# Altium project 3L-FC-Converter.PrjPcb
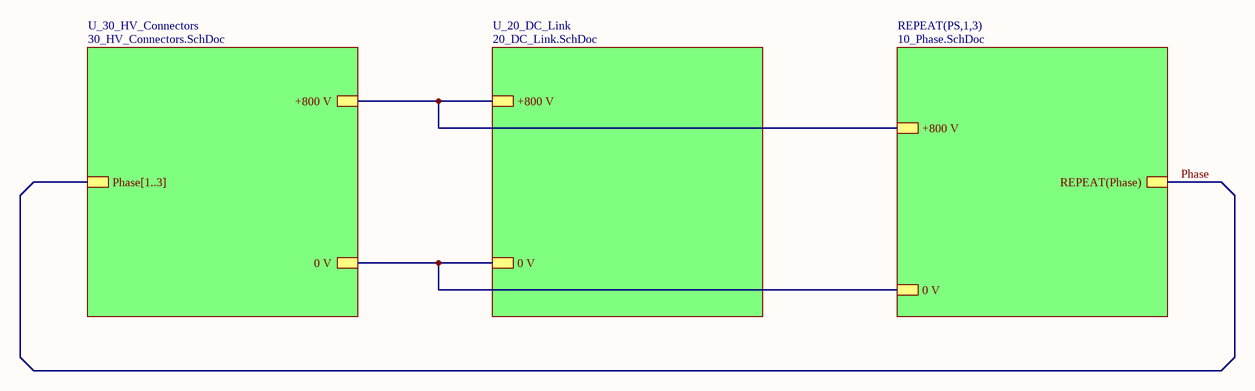
[diagram p0: 00_TopLevel.SchDoc]
4 sheets, 97 parts. Net scope: hierarchical (ports join the sheet entries above them; power ports are global).
Board file: Powerstage_3LFLC.PcbDoc.PcbDoc
Sheets:
  00_TopLevel.SchDoc
    PS1 = 10_Phase.SchDoc
    PS2 = 10_Phase.SchDoc
    PS3 = 10_Phase.SchDoc
    U_20_DC_Link = 20_DC_Link.SchDoc
    U_30_HV_Connectors = 30_HV_Connectors.SchDoc

## Sheet 00_TopLevel.SchDoc
size A4; SheetNumber: 1; SheetTotal: 4

### Sub-sheets
REPEAT(PS,1,3) = 10_Phase.SchDoc: REPEAT(Phase), +800 V, 0 V
U_20_DC_Link = 20_DC_Link.SchDoc: +800 V, 0 V
U_30_HV_Connectors = 30_HV_Connectors.SchDoc: 0 V, +800 V, Phase[1..3]

### Nets
0 V: sheet REPEAT(PS,1,3)/0 V, sheet U_20_DC_Link/0 V, sheet U_30_HV_Connectors/0 V
+800 V: sheet REPEAT(PS,1,3)/+800 V, sheet U_20_DC_Link/+800 V, sheet U_30_HV_Connectors/+800 V
Phase: sheet REPEAT(PS,1,3)/REPEAT(Phase)

## Sheet 10_Phase.SchDoc
size A4; SheetNumber: 2; SheetTotal: 4
Used 3 times, as channels PS1, PS2, PS3. Parts and nets are listed once, with the designators drawn on the sheet.
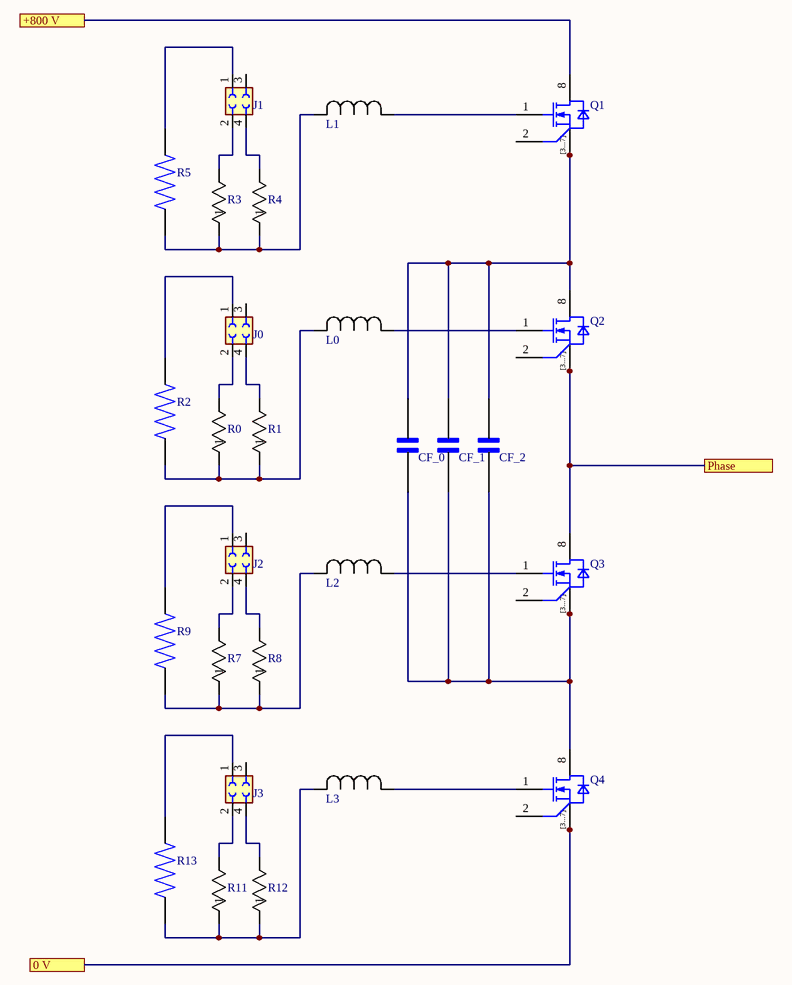
[diagram p1: 10_Phase.SchDoc]

### Parts
CF_0  B32776Z4406K000  [CAP_B32776Z4406K000]  (value not drawn)
CF_1  B32776Z4406K000  [CAP_B32776Z4406K000]  (value not drawn)
CF_2  B32776Z4406K000  [CAP_B32776Z4406K000]  (value not drawn)
J0  6230XX21021_62300421021  [62300421021]  (value not drawn)
J1  6230XX21021_62300421021  [62300421021]  (value not drawn)
J2  6230XX21021_62300421021  [62300421021]  (value not drawn)
J3  6230XX21021_62300421021  [62300421021]  (value not drawn)
L0  MPZ2012S300AT000  [IND_2012_TDK]  (value not drawn)
L1  MPZ2012S300AT000  [IND_2012_TDK]  (value not drawn)
L2  MPZ2012S300AT000  [IND_2012_TDK]  (value not drawn)
L3  MPZ2012S300AT000  [IND_2012_TDK]  (value not drawn)
Q1  IMBG120R026M2H  [TO127P1500X470-8N-2-V1]  (value not drawn)
Q2  IMBG120R026M2H  [TO127P1500X470-8N-2-V1]  (value not drawn)
Q3  IMBG120R026M2H  [TO127P1500X470-8N-2-V1]  (value not drawn)
Q4  IMBG120R026M2H  [TO127P1500X470-8N-2-V1]  (value not drawn)
R0  HCJ1206ZT0R00  [RES_HCJ1206_STP]  (value not drawn)
R1  HCJ1206ZT0R00  [RES_HCJ1206_STP]  (value not drawn)
R2  AF0805FR-07130RL  [RESC2012X60N]  (value not drawn)
R3  HCJ1206ZT0R00  [RES_HCJ1206_STP]  (value not drawn)
R4  HCJ1206ZT0R00  [RES_HCJ1206_STP]  (value not drawn)
R5  AF0805FR-07130RL  [RESC2012X60N]  (value not drawn)
R7  HCJ1206ZT0R00  [RES_HCJ1206_STP]  (value not drawn)
R8  HCJ1206ZT0R00  [RES_HCJ1206_STP]  (value not drawn)
R9  AF0805FR-07130RL  [RESC2012X60N]  (value not drawn)
R11  HCJ1206ZT0R00  [RES_HCJ1206_STP]  (value not drawn)
R12  HCJ1206ZT0R00  [RES_HCJ1206_STP]  (value not drawn)
R13  AF0805FR-07130RL  [RESC2012X60N]  (value not drawn)

### Ports
0 V (see 00_TopLevel, 20_DC_Link, 30_HV_Connectors), +800 V (see 00_TopLevel, 20_DC_Link, 30_HV_Connectors), Phase (see 00_TopLevel)

### Nets
0 V: Q4.3(SOURCE1) Q4.4(SOURCE2) Q4.5(SOURCE3) Q4.6(SOURCE4) Q4.7(SOURCE5) ; port 0 V
+800 V: Q1.8(DRAIN) ; port +800 V
Phase: Q2.3(SOURCE1) Q2.4(SOURCE2) Q2.5(SOURCE3) Q2.6(SOURCE4) Q2.7(SOURCE5) Q3.8(DRAIN) ; port Phase
NetCF_0_1: CF_0.1 CF_1.1 CF_2.1 Q3.3(SOURCE1) Q3.4(SOURCE2) Q3.5(SOURCE3) Q3.6(SOURCE4) Q3.7(SOURCE5) Q4.8(DRAIN)
NetCF_0_2: CF_0.2 CF_1.2 CF_2.2 Q1.3(SOURCE1) Q1.4(SOURCE2) Q1.5(SOURCE3) Q1.6(SOURCE4) Q1.7(SOURCE5) Q2.8(DRAIN)
NetJ0_1: J0.1 R2.2
NetJ0_2: J0.2 R0.2
NetJ0_4: J0.4 R1.2
NetJ1_1: J1.1 R5.2
NetJ1_2: J1.2 R3.2
NetJ1_4: J1.4 R4.2
NetJ2_1: J2.1 R9.2
NetJ2_2: J2.2 R7.2
NetJ2_4: J2.4 R8.2
NetJ3_1: J3.1 R13.2
NetJ3_2: J3.2 R11.2
NetJ3_4: J3.4 R12.2
NetL0_1: L0.1 Q2.1(GATE)
NetL0_2: L0.2 R0.1 R1.1 R2.1
NetL1_1: L1.1 Q1.1(GATE)
NetL1_2: L1.2 R3.1 R4.1 R5.1
NetL2_1: L2.1 Q3.1(GATE)
NetL2_2: L2.2 R7.1 R8.1 R9.1
NetL3_1: L3.1 Q4.1(GATE)
NetL3_2: L3.2 R11.1 R12.1 R13.1

Not connected (* = marked no-connect by the designer): J0 3; J1 3; J2 3; J3 3; Q1 2(SENSE); Q2 2(SENSE); Q3 2(SENSE); Q4 2(SENSE)

### Channels
PS1: designators CF_0=C4_PS1 CF_1=C5_PS1 CF_2=C6_PS1 J0=J0_PS1 J1=J1_PS1 J2=J2_PS1 J3=J3_PS1 L0=L0_PS1 L1=L1_PS1 L2=L2_PS1 L3=L3_PS1 Q1=Q1_PS1 Q2=Q2_PS1 Q3=Q3_PS1 Q4=Q4_PS1 R0=R0_PS1 R1=R1_PS1 R2=R2_PS1 R3=R3_PS1 R4=R4_PS1 R5=R5_PS1 R7=R7_PS1 R8=R8_PS1 R9=R9_PS1 R11=R11_PS1 R12=R12_PS1 R13=R13_PS1; ports 0 V=0 V +800 V=+800 V Phase=Phase1
PS2: designators CF_0=C4_PS2 CF_1=C5_PS2 CF_2=C6_PS2 J0=J0_PS2 J1=J1_PS2 J2=J2_PS2 J3=J3_PS2 L0=L0_PS2 L1=L1_PS2 L2=L2_PS2 L3=L3_PS2 Q1=Q1_PS2 Q2=Q2_PS2 Q3=Q3_PS2 Q4=Q4_PS2 R0=R0_PS2 R1=R1_PS2 R2=R2_PS2 R3=R3_PS2 R4=R4_PS2 R5=R5_PS2 R7=R7_PS2 R8=R8_PS2 R9=R9_PS2 R11=R11_PS2 R12=R12_PS2 R13=R13_PS2; ports 0 V=0 V +800 V=+800 V Phase=Phase2
PS3: designators CF_0=C4_PS3 CF_1=C5_PS3 CF_2=C6_PS3 J0=J0_PS3 J1=J1_PS3 J2=J2_PS3 J3=J3_PS3 L0=L0_PS3 L1=L1_PS3 L2=L2_PS3 L3=L3_PS3 Q1=Q1_PS3 Q2=Q2_PS3 Q3=Q3_PS3 Q4=Q4_PS3 R0=R0_PS3 R1=R1_PS3 R2=R2_PS3 R3=R3_PS3 R4=R4_PS3 R5=R5_PS3 R7=R7_PS3 R8=R8_PS3 R9=R9_PS3 R11=R11_PS3 R12=R12_PS3 R13=R13_PS3; ports 0 V=0 V +800 V=+800 V Phase=Phase3

### Notes on the sheet
- (in symbol IMBG120R026M2H) [3...7]

### Library data of the parts
CF_0-CF_2 = B32776Z4406K000: 40 ÂµF Film Capacitor 500V Polypropylene (PP), Metallized Radial - 4 Leads; MF: EPCOS; SnapEDA_Link: https://www.snapeda.com/parts/B32776Z4406K000/EPCOS/view-part/?ref=snap; Package: NON-STANDARD-4 EPCOS; Value: *; MP: B32776Z4406K000; Check_prices: https://www.snapeda.com/parts/B32776Z4406K000/EPCOS/view-part/?ref=eda
J0-J3 = 6230XX21021_62300421021: WR-PHD 1.27 mm Dual SMT Socket Header H=4.50mm; MF: Wurth Elektronik; SnapEDA_Link: https://www.snapeda.com/parts/62300421021/Wurth+Electronics/view-part/?ref=snap; Package: None; Value: *; MP: 62300421021; Check_prices: https://www.snapeda.com/parts/62300421021/Wurth+Electronics/view-part/?ref=eda
L0-L3 = MPZ2012S300AT000: Description; Manufacturer_Name: TDK; Copyright: Copyright (C) 2025 Ultra Librarian. All rights reserved.; Manufacturer_Part_Number: MPZ2012S300AT000
Q1-Q4 = IMBG120R026M2H: Insulated-Gate Field-Effect Transistor (IGFET), N-Channel, Enhancement, Body Diode, Pin 1 Gate, 2 Sense, 3 Source, 4 Source, 5 Source, 6 Source, 7 Source, 8 Drain, 8 Pins; Manufacturer: Infineon Technologies; Manufacturer Order Number: IMBG120R026M2H; Package Reference: PG-TO263-7-12
R0 R1 R3 R4 R7 R8 R11 R12 = HCJ1206ZT0R00: Description; Manufacturer_Name: Stackpole International; Copyright: Copyright (C) 2025 Ultra Librarian. All rights reserved.; Manufacturer_Part_Number: HCJ1206ZT0R00
R2 R5 R9 R13 = AF0805FR-07130RL: 130 Ohms Â±1% 0.125W, 1/8W Chip Resistor 0805 (2012 Metric) Anti-Sulfur, Automotive AEC-Q200 Thick Film; MF: Yageo; SnapEDA_Link: https://www.snapeda.com/parts/AF0805FR-07130RL/Yageo/view-part/?ref=snap; Package: 2012 Yageo; Value: *; MP: AF0805FR-07130RL; Check_prices: https://www.snapeda.com/parts/AF0805FR-07130RL/Yageo/view-part/?ref=eda

## Sheet 20_DC_Link.SchDoc
size A4; SheetNumber: 3; SheetTotal: 4
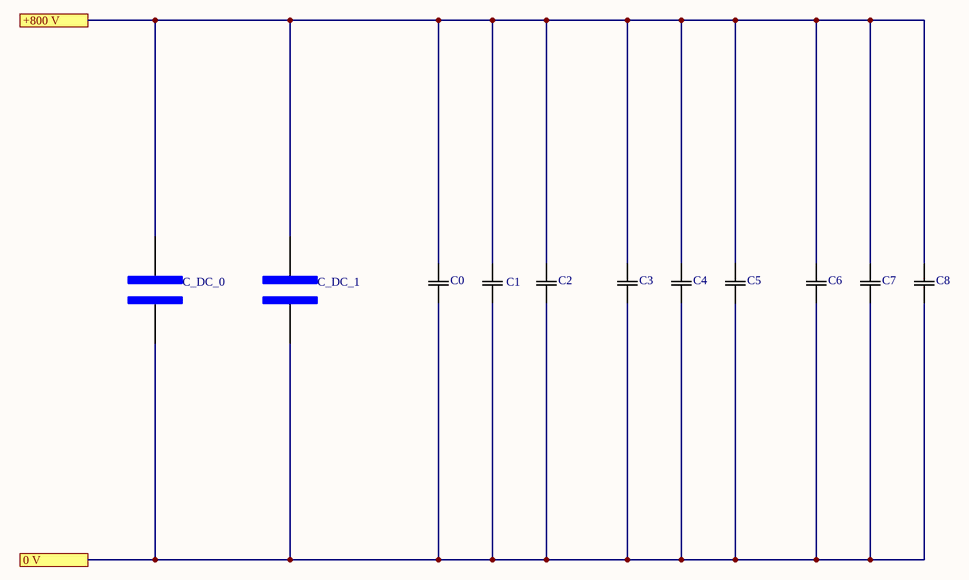
[diagram p2: 20_DC_Link.SchDoc]

### Parts
C0  2220Y1K00474KETWS2  [CAP_2220Y_KNO]  (value not drawn)
C1  2220Y1K00474KETWS2  [CAP_2220Y_KNO]  (value not drawn)
C2  2220Y1K00474KETWS2  [CAP_2220Y_KNO]  (value not drawn)
C3  2220Y1K00474KETWS2  [CAP_2220Y_KNO]  (value not drawn)
C4  2220Y1K00474KETWS2  [CAP_2220Y_KNO]  (value not drawn)
C5  2220Y1K00474KETWS2  [CAP_2220Y_KNO]  (value not drawn)
C6  2220Y1K00474KETWS2  [CAP_2220Y_KNO]  (value not drawn)
C7  2220Y1K00474KETWS2  [CAP_2220Y_KNO]  (value not drawn)
C8  2220Y1K00474KETWS2  [CAP_2220Y_KNO]  (value not drawn)
C_DC_0  B25654A6177K001  [B25654A6177K001]  (value not drawn)
C_DC_1  B25654A6177K001  [B25654A6177K001]  (value not drawn)

### Ports
0 V (see 00_TopLevel, 10_Phase, 30_HV_Connectors), +800 V (see 00_TopLevel, 10_Phase, 30_HV_Connectors)

### Nets
0 V: C0.1 C1.1 C2.1 C3.1 C4.1 C5.1 C6.1 C7.1 C8.1 C_DC_0.2 C_DC_1.2 ; port 0 V
+800 V: C0.2 C1.2 C2.2 C3.2 C4.2 C5.2 C6.2 C7.2 C8.2 C_DC_0.1 C_DC_1.1 ; port +800 V

### Library data of the parts
C0-C8 = 2220Y1K00474KETWS2: Description; Manufacturer_Name: Knowles; Type: Ceramic Capacitors; Copyright: Copyright (C) 2026 Ultra Librarian. All rights reserved.; Manufacturer_Part_Number: 2220Y1K00474KETWS2

## Sheet 30_HV_Connectors.SchDoc
size A4; SheetNumber: 4; SheetTotal: 4
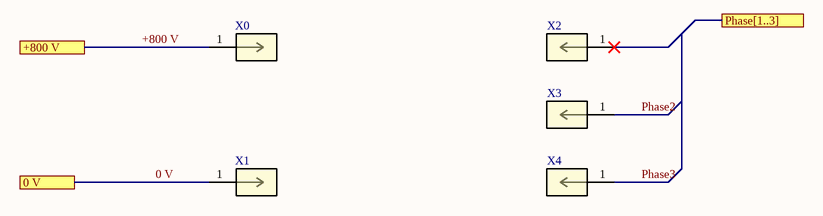
[diagram p3: 30_HV_Connectors.SchDoc]

### Parts
X0  1379-1  [CONN_1379-1_KEY]  (value not drawn)
X1  1379-1  [CONN_1379-1_KEY]  (value not drawn)
X2  1379-1  [CONN_1379-1_KEY]  (value not drawn)
X3  1379-1  [CONN_1379-1_KEY]  (value not drawn)
X4  1379-1  [CONN_1379-1_KEY]  (value not drawn)

### Ports
0 V (see 00_TopLevel, 10_Phase, 20_DC_Link), +800 V (see 00_TopLevel, 10_Phase, 20_DC_Link), Phase[1..3] (see 00_TopLevel)

### Nets
0 V: X1.1 ; port 0 V
+800 V: X0.1 ; port +800 V
Phase2: X3.1
Phase3: X4.1

Not connected (* = marked no-connect by the designer): X2 1*

### Library data of the parts
X0-X4 = 1379-1: Description; Manufacturer_Name: Keystone Electronics; Copyright: Copyright (C) 2025 Ultra Librarian. All rights reserved.; Manufacturer_Part_Number: 1379-1; RefDes: RefDes; Type: Type

## Nets that join several sheets
0 V: PS1 (5 pins), PS2 (5 pins), PS3 (5 pins), 20_DC_Link (11 pins), 30_HV_Connectors (X1.1)
+800 V: PS1 (Q1_PS1.8), PS2 (Q1_PS2.8), PS3 (Q1_PS3.8), 20_DC_Link (11 pins), 30_HV_Connectors (X0.1)